# Altium schematic sheet PART-01-抢答输入、锁存、显示电路R50-99.SchDoc
size A4
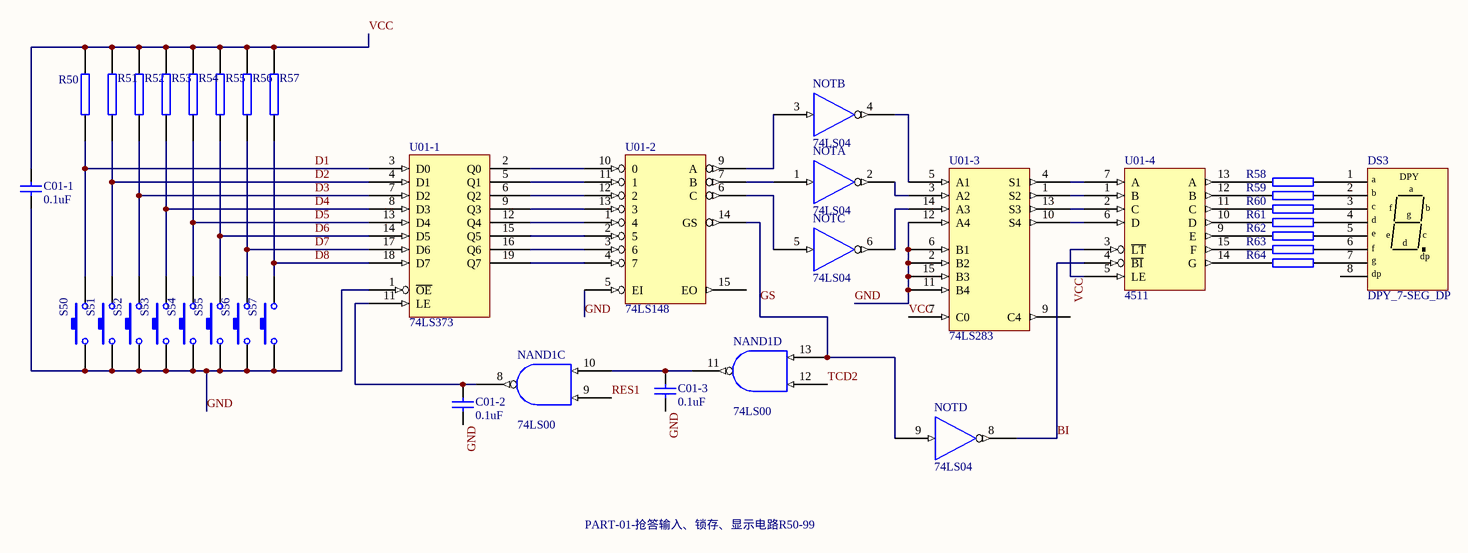
[diagram p0: PART-01-抢答输入、锁存、显示电路R50-99.SchDoc]

## Parts
C01-1  value 0.1uF  [RAD-0.3]  (hidden comment: Cap)
C01-2  value 0.1uF  [RAD-0.3]  (hidden comment: Cap)
C01-3  value 0.1uF  [RAD-0.3]  (hidden comment: Cap)
DS3  DPY_7-SEG_DP  [8-.5]
NAND1  74LS00  [DIP-14]  (parts C,D of 4)
NOT  74LS04  [DIP-14]  (parts A,B,C,D of 6)
R50  ES2  (value not drawn)
R51  RES2  (value not drawn)
R52  RES2  (value not drawn)
R53  RES2  (value not drawn)
R54  RES2  (value not drawn)
R55  RES2  (value not drawn)
R56  RES2  (value not drawn)
R57  RES2  (value not drawn)
R58  RES2  (value not drawn)
R59  RES2  (value not drawn)
R60  RES2  (value not drawn)
R61  RES2  (value not drawn)
R62  RES2  (value not drawn)
R63  RES2  (value not drawn)
R64  RES2  (value not drawn)
S50  SW-PB  [SPST-2]  (value not drawn)
S51  SW-PB  [SPST-2]  (value not drawn)
S52  SW-PB  [SPST-2]  (value not drawn)
S53  SW-PB  [SPST-2]  (value not drawn)
S54  SW-PB  [SPST-2]  (value not drawn)
S55  SW-PB  [SPST-2]  (value not drawn)
S56  SW-PB  [SPST-2]  (value not drawn)
S57  SW-PB  [SPST-2]  (value not drawn)
U01-1  74LS373  [DIP-20]
U01-2  74LS148  [DIP-16]
U01-3  74LS283  [DIP-16]
U01-4  4511  [DIP-16]

## Nets
GND: C01-1.1 C01-2.1 C01-3.1 NAND1.7(GND) NOT.7(GND) S50.1 S51.1 S52.1 S53.1 S54.1 S55.1 S56.1 S57.1 U01-1.1(~{OE}) U01-1.10(GND) U01-2.5(EI) U01-2.8(GND) U01-3.2(B2) U01-3.6(B1) U01-3.8(GND) U01-3.11(B4) U01-3.12(A4) U01-3.15(B3) U01-4.8(GND)
VCC: C01-1.2 NAND1.14(VCC) NOT.14(VCC) R50.2 R51.2 R52.2 R53.2 R54.2 R55.2 R56.2 R57.2 U01-1.20(VCC) U01-2.16(VCC) U01-3.7(C0) U01-3.16(VCC) U01-4.3(~{LT}) U01-4.5(LE) U01-4.16(VCC)
BI: NOT.8 U01-4.4(~{BI})
D1: R50.1 S50.2 U01-1.3(D0)
D2: R51.1 S51.2 U01-1.4(D1)
D3: R52.1 S52.2 U01-1.7(D2)
D4: R53.1 S53.2 U01-1.8(D3)
D5: R54.1 S54.2 U01-1.13(D4)
D6: R55.1 S55.2 U01-1.14(D5)
D7: R56.1 S56.2 U01-1.17(D6)
D8: R57.1 S57.2 U01-1.18(D7)
GS: NAND1.13 NOT.9 U01-2.14(GS)
RES1: NAND1.9
TCD2: NAND1.12
NetC01-2_2: C01-2.2 NAND1.8 U01-1.11(LE)
NetC01-3_2: C01-3.2 NAND1.10 NAND1.11
NetDS3_1: DS3.1(a) R58.2
NetDS3_2: DS3.2(b) R59.2
NetDS3_3: DS3.3(c) R60.2
NetDS3_4: DS3.4(d) R61.2
NetDS3_5: DS3.5(e) R62.2
NetDS3_6: DS3.6(f) R63.2
NetDS3_7: DS3.7(g) R64.2
NetNOT_1: NOT.1 U01-2.7(B)
NetNOT_2: NOT.2 U01-3.3(A2)
NetNOT_3: NOT.3 U01-2.9(A)
NetNOT_4: NOT.4 U01-3.5(A1)
NetNOT_5: NOT.5 U01-2.6(C)
NetNOT_6: NOT.6 U01-3.14(A3)
NetR58_1: R58.1 U01-4.13(A)
NetR59_1: R59.1 U01-4.12(B)
NetR60_1: R60.1 U01-4.11(C)
NetR61_1: R61.1 U01-4.10(D)
NetR62_1: R62.1 U01-4.9(E)
NetR63_1: R63.1 U01-4.15(F)
NetR64_1: R64.1 U01-4.14(G)
NetU01-1_2: U01-1.2(Q0) U01-2.10(0)
NetU01-1_5: U01-1.5(Q1) U01-2.11(1)
NetU01-1_6: U01-1.6(Q2) U01-2.12(2)
NetU01-1_9: U01-1.9(Q3) U01-2.13(3)
NetU01-1_12: U01-1.12(Q4) U01-2.1(4)
NetU01-1_15: U01-1.15(Q5) U01-2.2(5)
NetU01-1_16: U01-1.16(Q6) U01-2.3(6)
NetU01-1_19: U01-1.19(Q7) U01-2.4(7)
NetU01-3_1: U01-3.1(S2) U01-4.1(B)
NetU01-3_4: U01-3.4(S1) U01-4.7(A)
NetU01-3_10: U01-3.10(S4) U01-4.6(D)
NetU01-3_13: U01-3.13(S3) U01-4.2(C)

Not connected (* = marked no-connect by the designer): DS3 8(dp); U01-2 15(EO); U01-3 9(C4)

## Notes on the sheet
- PART-01-抢答输入、锁存、显示电路R50-99
- (in symbol DPY_7-SEG_DP) DPY

## Library data of the parts
C01-1-C01-3 = Cap: Capacitor; Published: 8-Jun-2000; LatestRevisionDate: 17-Jul-2002; LatestRevisionNote: Re-released for DXP Platform.; PackageReference: RAD-0.3; Publisher: Altium Limited
DS3 = DPY_7-SEG_DP: Seven-Segment Display, Right Hand Decimal
R50 = RES2
S50-S57 = SW-PB: Switch; Published: 24-Mar-1999; LatestRevisionDate: 17-Jul-2002; LatestRevisionNote: Re-released for DXP Platform.; PackageReference: SPST-2; Publisher: Altium Limited